# Altium schematic sheet 780-00029,rev3,Pg2,Backplane, Instrument Crate.SchDoc
size B; PageSetup: Record=PageOptions|CenterHorizontal=True|CenterVertical=True|PrintScale=1.09|XCorrection=1.00|YCorrection=1.00|PrintKind=0|BorderSize=5000000|LeftOffset=0|BottomOffset=0|Orientation=2|PaperLength=1000|PaperWidth=1000|Scale=100|PaperSource=7|PrintQuality=-4|MediaType=1|DitherType=10|PaperKind=Tabloid 11 x 17in|PrintScaleMode=1
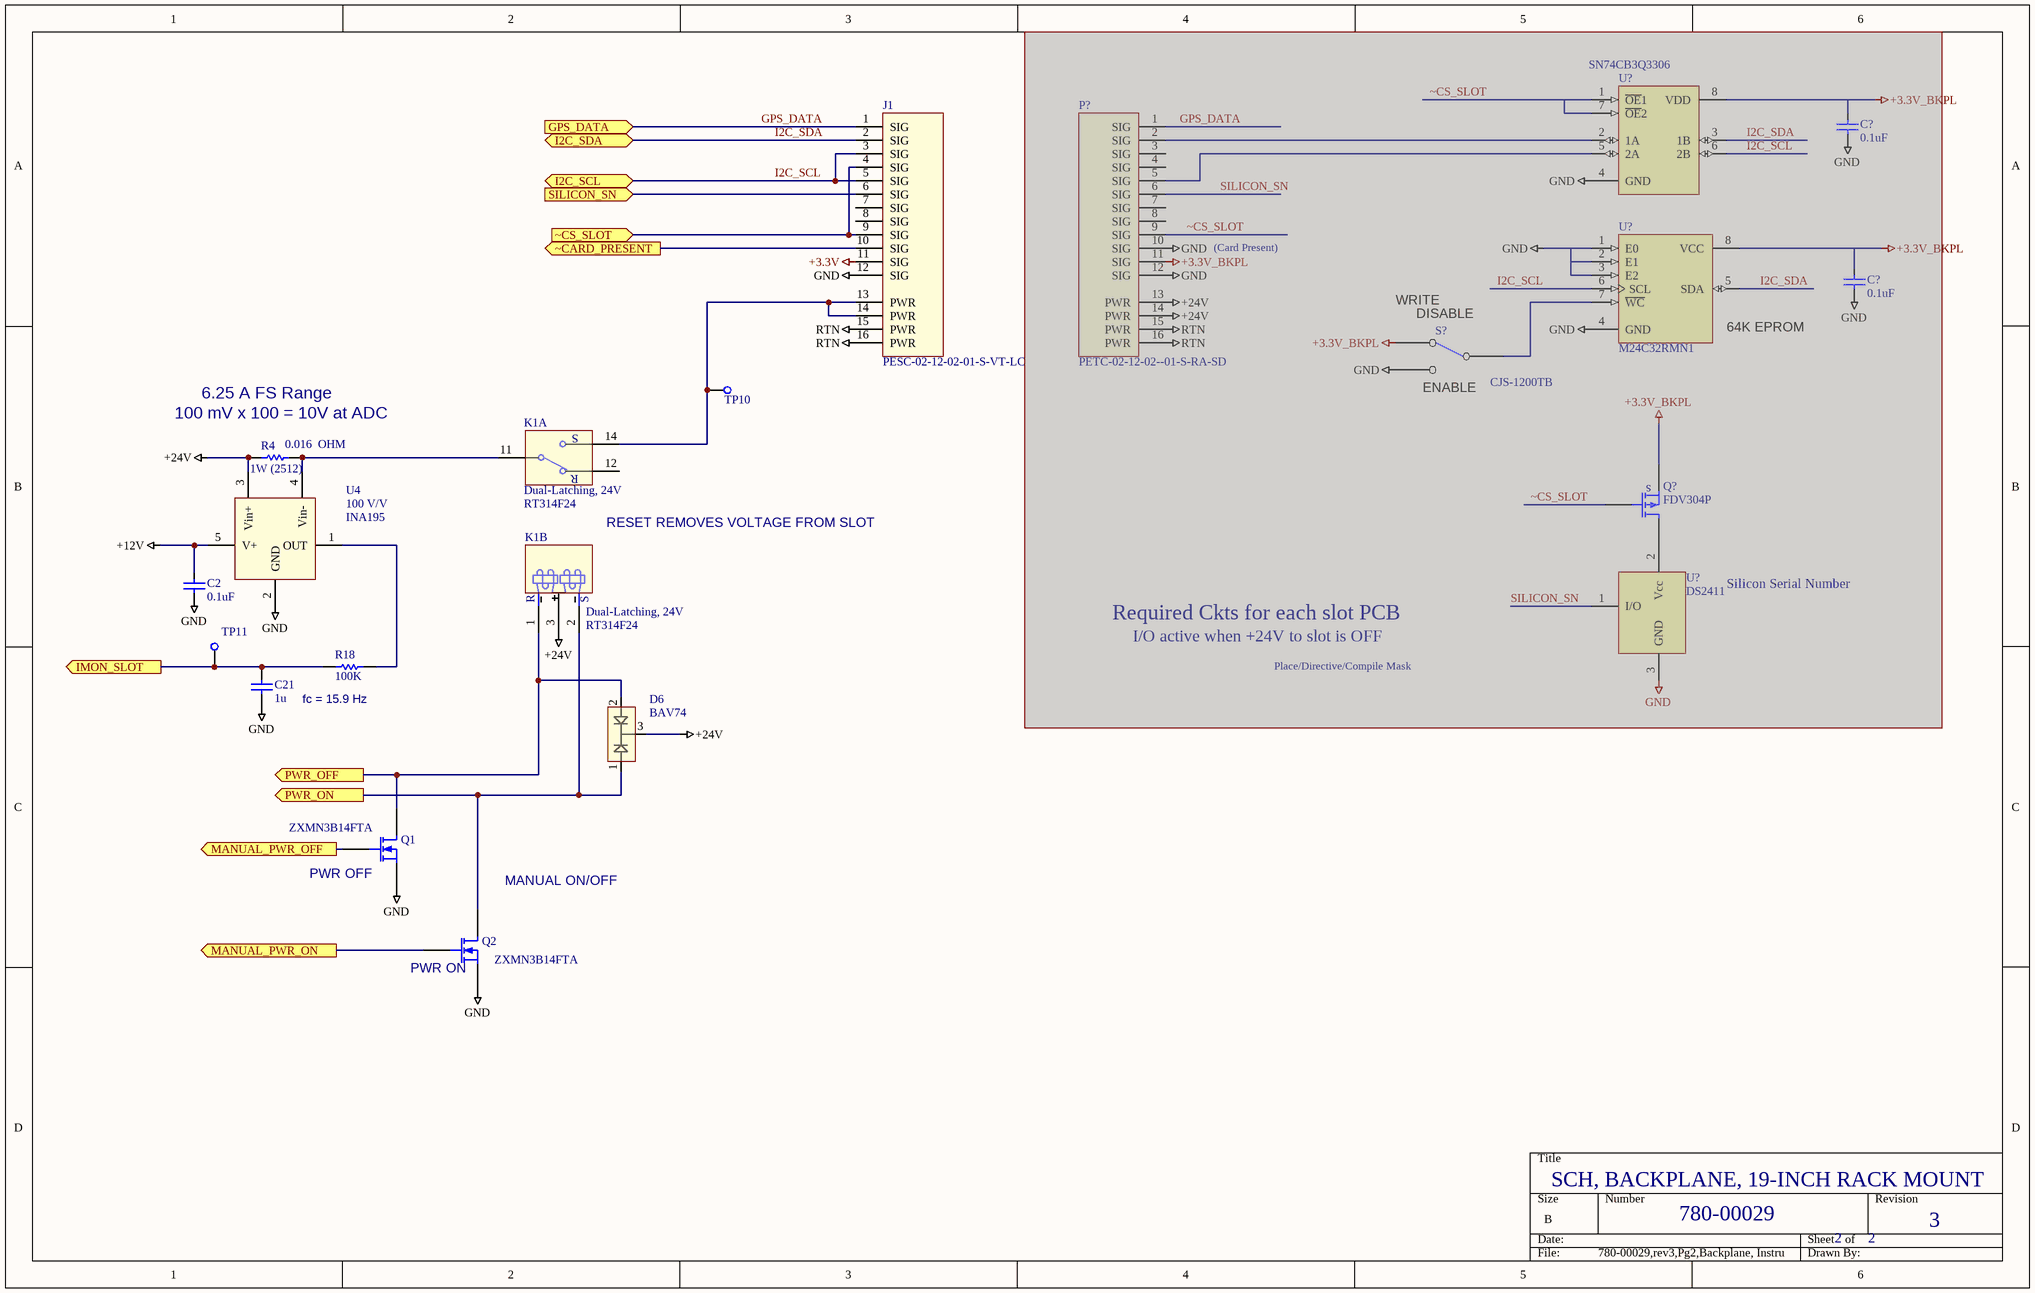
[diagram p0: 780-00029,rev3,Pg2,Backplane, Instrument Crate.SchDoc]

## Parts
(Parts that share a designator on the sheet are numbered #1, #2 ... from top to bottom, then left to right.)
C2  value 0.1uF  [SMD_0805]  (hidden comment: Cap SMD)
C21  1u  [SMD_0805]
C?#1  value 0.1uF  [SMD_0805]  (hidden comment: Cap SMD)  (masked out: inside a compile mask, not in the netlist)
C?#2  value 0.1uF  [SMD_0805]  (hidden comment: Cap SMD)  (masked out: inside a compile mask, not in the netlist)
D6  BAV74  [SOT23A]
J1  PESC-02-12-02-01-S-VT-LC  [PESC-02-12-02-01-S-VT-LC]
K1  Dual-Latching, 24V  value RT314F24  [RELAY, TYCO RT1]  (parts A,B of 2)
P?  PETC-02-12-02--01-S-RA-SD  [PETC-02-12-02-01-RA]  (masked out: inside a compile mask, not in the netlist)
Q1  ZXMN3B14FTA  [SOT-23B]
Q2  ZXMN3B14FTA  [SOT-23B]
Q?  FDV304P  [SMD_SOT23_3]  (masked out: inside a compile mask, not in the netlist)
R4  1W (2512)  value 0.016  OHM  [6332[2512]]
R18  value 100K  [SMD_0805]  (hidden comment: Res 0805)
S?  CJS-1200TB  [CAS-120B]  (masked out: inside a compile mask, not in the netlist)
TP10  Test point  [PAD_80D_052H]  (value not drawn)
TP11  Test point  [PAD_80D_052H]  (value not drawn)
U4  100 V/V  value INA195  [SMD_SOT23_5]
U?#1  value SN74CB3Q3306  [PW008_N]  (hidden comment: SN74CBT3306PWLE)  (masked out: inside a compile mask, not in the netlist)
U?#2  M24C32RMN1  [SOP8_N]  (masked out: inside a compile mask, not in the netlist)
U?#3  DS2411  [SMD_SOT23_3]  (masked out: inside a compile mask, not in the netlist)

## Ports
GPS_DATA (in), I2C_SCL, I2C_SDA, IMON_SLOT (out), MANUAL_PWR_OFF (out), MANUAL_PWR_ON (out), PWR_OFF (out), PWR_ON (out), SILICON_SN (in), ~CARD_PRESENT (out), ~CS_SLOT (in)

## Nets
+3.3V: J1.11(SIG)
+12V: C2.2 U4.5(V+)
+24V: D6.3(AC2) K1.3(Com) R4.1 U4.3(Vin+)
GND: C2.1 C21.2 J1.12(SIG) Q1.3(S) Q2.3(S) U4.2(GND)
RTN: J1.15(PWR) J1.16(PWR)
GPS_DATA: J1.1(SIG) ; port GPS_DATA
I2C_SCL: J1.3(SIG) J1.5(SIG) ; port I2C_SCL
I2C_SDA: J1.2(SIG) ; port I2C_SDA
IMON_SLOT: C21.1 R18.1 TP11.1(TP) ; port IMON_SLOT
MANUAL_PWR_OFF: Q1.2(G) ; port MANUAL_PWR_OFF
MANUAL_PWR_ON: Q2.2(G) ; port MANUAL_PWR_ON
PWR_OFF: D6.2(C1) K1.1(Reset) Q1.1(D) ; port PWR_OFF
PWR_ON: D6.1(A1) K1.2(Reset) Q2.1(D) ; port PWR_ON
SILICON_SN: J1.6(SIG) ; port SILICON_SN
~CARD_PRESENT: J1.10(SIG) ; port ~CARD_PRESENT
~CS_SLOT: J1.4(SIG) J1.9(SIG) ; port ~CS_SLOT
NetJ1_13: J1.13(PWR) J1.14(PWR) K1.14(S) TP10.1(TP)
NetK1_11: K1.11(Wiper) R4.2 U4.4(Vin-)
NetR18_2: R18.2 U4.1(OUT)

Not connected (* = marked no-connect by the designer): J1 7(SIG) 8(SIG); K1 12(R)

## Notes on the sheet
- (Card Present)
- (near S?) WRITE
- (near S?) DISABLE
- (near U?#2) 64K EPROM
- (near R4) 100 mV x 100 = 10V at ADC
- 6.25 A FS Range
- (near S?) ENABLE
- (near K1) RESET REMOVES VOLTAGE FROM SLOT
- Required Ckts for each slot PCB
- I/O active when +24V to slot is OFF
- Silicon Serial Number
- fc = 15.9 Hz
- Place/Directive/Compile Mask
- (near Q1) PWR OFF
- MANUAL ON/OFF
- (near Q2) PWR ON
- SCH, BACKPLANE, 19-INCH RACK MOUNT
- 780-00029
- 2
- 3
- (in symbol FDV304P) s

## Library data of the parts
C2 = Cap SMD: Capacitor; LCO p/n: 120-00002
C21 = Cap: Capacitor; Manufacturer: Taiyo Yuden; Manuf p/n: UMK212F105ZG-T; Vendor: DIGIKEY; Vendor Mult.: 10; Vendor p/n: 587-1308-1-ND; LCO p/n: 120-00027; Value: 1u; COST: 0.088
C?#1 C?#2 = Cap SMD: Capacitor; Manufacturer: AVX; Manuf p/n: 08055C104KAT2A; Vendor: DigiKey; Vendor p/n: 478-1395-1-ND; Vendor Mult.: 10; Arena Prefix: 120; LCO P/N: 120-00002; COST: 0.088; Arena Type: Capacitor
D6 = DIODE, PAIR, COM CATHODE: LCO p/n: 150-00095; Vendor: Digi-Key; Vendor p/n: 568-1623-1-ND
J1 = PESC-02-12-02-01-S-VT-LC: SAMTEC, SIGNAL(12)+PWR(4), VERT; LCO p/n: 125-00088; Manufacturer: Samtec; Manuf p/n: PESC-02-12-02-01-S-VT-LC; VALUE: PESC-02-12-02-01-S-VT-LC; Vendor: Samtec; Vendor p/n: PESC-02-12-02-01-S-VT-LC
K1 = Relay SPDT, 16A: Tyco/Schrack RT314F24, Dual Latching; Vendor: DigiKey; Vendor Mult.: 1; Vendor p/n: PB1086-ND; LCO p/n: 183-00001; COST: 3.79; Manufacturer: Tyco/Schrack; Manuf p/n: RT314F24
P? = PETC-02-12-02--01-S-RA-SD: SAMTEC, SIGNAL(12)+PWR(4); Vendor Mult.: 1; Manufacturer: SAMTEC; Manuf p/n: PETC-02-12-02--01-S-RA-SD; Vendor: SAMTEC; Vendor p/n: PETC-02-12-02--01-S-RA-SD
Q1 Q2 = MOSFET-N: N-Channel MOSFET; pin to pad: 1>3 2>1 3>2; Manufacturer: ZETEX; Manuf p/n: ZXMN3B01FTA; Value: ZXMN3B01; Vendor: DIGIKEY; Vendor Mult.: 1; Vendor p/n: ZXMN3B01FCT-ND; LCO p/n: 195-00002; COST: 0.69
Q? = FDV304P: P-MOSFET LOGIC LEVEL; Manufacturer: Fairchild; Vendor: DigiKey; Vendor p/n: FDV304PCT-ND; Vendor Mult.: 1; Arena Prefix: 195; Arena Type: Transistor; LCO P/N: 195-00004; COST: 0.46; Manuf p/n: FDV304P; Value: FDV304P
R4 = Res SMD: Resistor 0805; Manufacturer: Panasonic; Manuf p/n: ERJ-M1WSJ16MU; Vendor: DIGIKEY; Vendor p/n: P16TCT-ND; Vendor Mult.: 1; LCO p/n: 181-R0160; COST: 1.07
R18 = Res SMD: Resistor 0805; Manufacturer: Vishay/Dale; Manuf p/n: CRCW0805100KFKEA; Vendor: DIGIKEY; Vendor p/n: 541-100KCCT-ND; Vendor Mult.: 10; LCO p/n: 181-01003; COST: 0.09
S? = SW_SPDT_DOUG: Manufacturer: Copal Electronics; Manuf p/n: CAS-120TA; Vendor: DIGIKEY; Vendor Mult.: 1; Vendor p/n: CAS120JTR-ND; LCO p/n: 185-00010; COST: 1.27; Value: SW_SPDT
TP10 TP11 = Test point: Manufacturer: Keystone; Manuf p/n: 1249; Vendor: Bisco Ind.; LCO p/n: 125-00013; Vendor p/n: 1249; COST: 0.18; VALUE: Test point
U4 = INA195: Current Shunt Monitor; Manufacturer: TI; Manuf p/n: INA195AIDBVR; LCO p/n: 150-00100; Vendor: Digi-Key; Vendor Mult.: 1; Vendor p/n: 296-26067-1-ND; COST: 2.80
U?#1 = SN74CBT3306PWLE: Dual FET Bus Switch; Manufacturer: TI; Manuf p/n: SN74CB3Q3306APWR; LCO p/n: 150-00083; Vendor: Digi-Key; Vendor Mult.: 1; Vendor p/n: 296-15102-1-ND; COST: 0.95
U?#2 = M24C32RMN1: 32 Kbit Serial I²C Bus EEPROM; LCO p/n: 150-00076
U?#3 = DS2411: Silicon Serial Number; Manufacturer: MAXIM; Manuf p/n: DS2411R+T&R; Vendor: DIGIKEY; Vendor p/n: DS2411R+CT-ND; Vendor Mult.: 1; LCO p/n: 150-00031; COST: 1.25; VALUE: DS2411